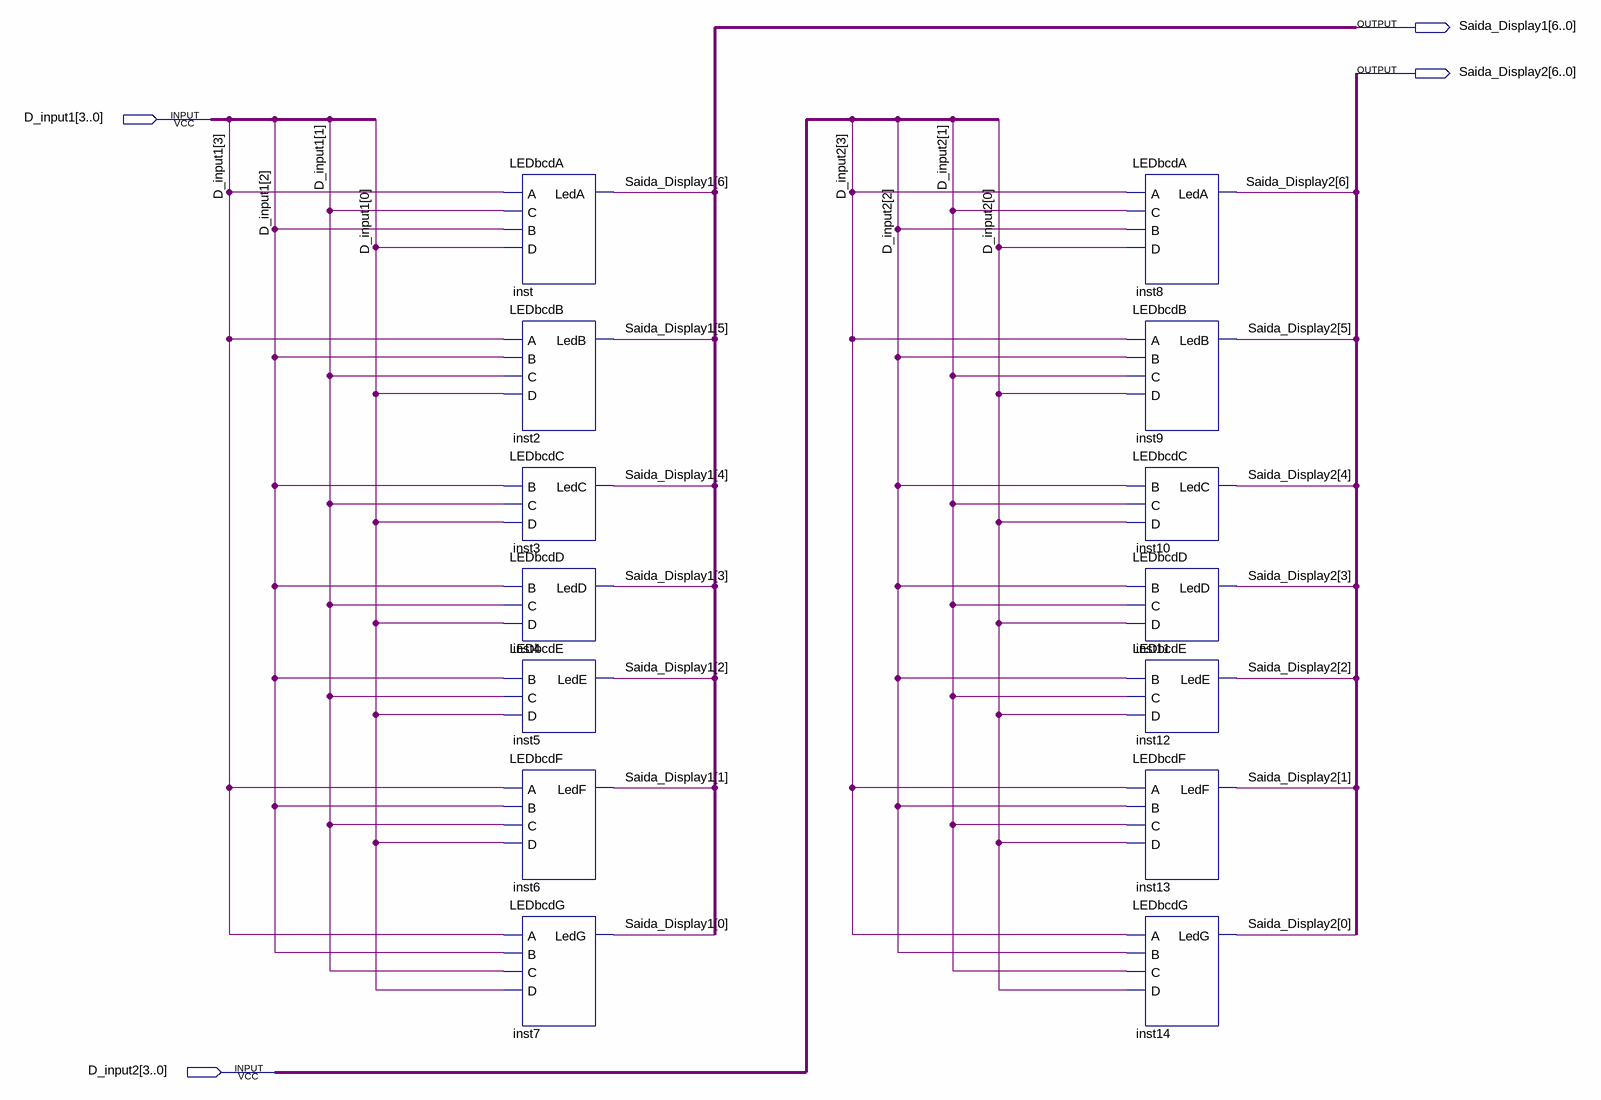
[diagram p0: schematic sheet]
// Quartus schematic DisplayBCD.bdf as structural Verilog: 14 symbols, 4 pins
module DisplayBCD (
  input  [3:0] D_input1,
  input  [3:0] D_input2,
  output [6:0] Saida_Display1,
  output [6:0] Saida_Display2
);

  LEDbcdA inst (.A(D_input1[3]), .C(D_input1[1]), .B(D_input1[2]), .D(D_input1[0]), .LedA(Saida_Display1[6]));
  LEDbcdB inst2 (.A(D_input1[3]), .B(D_input1[2]), .C(D_input1[1]), .D(D_input1[0]), .LedB(Saida_Display1[5]));
  LEDbcdC inst3 (.B(D_input1[2]), .C(D_input1[1]), .D(D_input1[0]), .LedC(Saida_Display1[4]));
  LEDbcdD inst4 (.B(D_input1[2]), .C(D_input1[1]), .D(D_input1[0]), .LedD(Saida_Display1[3]));
  LEDbcdE inst5 (.B(D_input1[2]), .C(D_input1[1]), .D(D_input1[0]), .LedE(Saida_Display1[2]));
  LEDbcdF inst6 (.A(D_input1[3]), .B(D_input1[2]), .C(D_input1[1]), .D(D_input1[0]), .LedF(Saida_Display1[1]));
  LEDbcdG inst7 (.A(D_input1[3]), .B(D_input1[2]), .C(D_input1[1]), .D(D_input1[0]), .LedG(Saida_Display1[0]));
  LEDbcdA inst8 (.A(D_input2[3]), .C(D_input2[1]), .B(D_input2[2]), .D(D_input2[0]), .LedA(Saida_Display2[6]));
  LEDbcdB inst9 (.A(D_input2[3]), .B(D_input2[2]), .C(D_input2[1]), .D(D_input2[0]), .LedB(Saida_Display2[5]));
  LEDbcdC inst10 (.B(D_input2[2]), .C(D_input2[1]), .D(D_input2[0]), .LedC(Saida_Display2[4]));
  LEDbcdD inst11 (.B(D_input2[2]), .C(D_input2[1]), .D(D_input2[0]), .LedD(Saida_Display2[3]));
  LEDbcdE inst12 (.B(D_input2[2]), .C(D_input2[1]), .D(D_input2[0]), .LedE(Saida_Display2[2]));
  LEDbcdF inst13 (.A(D_input2[3]), .B(D_input2[2]), .C(D_input2[1]), .D(D_input2[0]), .LedF(Saida_Display2[1]));
  LEDbcdG inst14 (.A(D_input2[3]), .B(D_input2[2]), .C(D_input2[1]), .D(D_input2[0]), .LedG(Saida_Display2[0]));
endmodule
